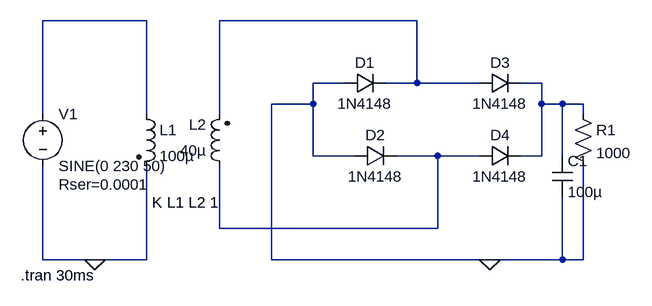
[diagram p0: schematic EXP-1_BridgeRectifier.asc]
EXP-1_BridgeRectifier.asc, the LTspice schematic file:
Version 4
SHEET 1 980 680
WIRE 224 -16 64 -16
WIRE 640 -16 336 -16
WIRE 528 80 480 80
WIRE 640 80 640 -16
WIRE 640 80 592 80
WIRE 736 80 640 80
WIRE 832 80 800 80
WIRE 480 112 480 80
WIRE 480 112 416 112
WIRE 832 112 832 80
WIRE 864 112 832 112
WIRE 896 112 864 112
WIRE 64 128 64 -16
WIRE 224 128 224 -16
WIRE 336 128 336 -16
WIRE 896 128 896 112
WIRE 480 192 480 112
WIRE 544 192 480 192
WIRE 672 192 608 192
WIRE 736 192 672 192
WIRE 832 192 832 112
WIRE 832 192 800 192
WIRE 864 192 864 112
WIRE 336 304 336 208
WIRE 672 304 672 192
WIRE 672 304 336 304
WIRE 64 352 64 208
WIRE 144 352 64 352
WIRE 224 352 224 208
WIRE 224 352 144 352
WIRE 416 352 416 112
WIRE 752 352 416 352
WIRE 864 352 864 256
WIRE 864 352 752 352
WIRE 896 352 896 208
WIRE 896 352 864 352
FLAG 144 352 0
FLAG 752 352 0
SYMBOL voltage 64 112 R0
WINDOW 123 0 0 Left 0
WINDOW 39 24 124 Left 2
SYMATTR InstName V1
SYMATTR Value SINE(0 230 50)
SYMATTR SpiceLine Rser=0.0001
SYMBOL ind2 208 112 R0
SYMATTR InstName L1
SYMATTR Value 100µ
SYMATTR Type ind
SYMBOL ind2 352 224 R180
WINDOW 0 36 80 Left 2
WINDOW 3 36 40 Left 2
SYMATTR InstName L2
SYMATTR Value 40µ
SYMATTR Type ind
SYMBOL diode 528 96 R270
WINDOW 0 32 32 VTop 2
WINDOW 3 0 32 VBottom 2
SYMATTR InstName D1
SYMATTR Value 1N4148
SYMBOL diode 544 208 R270
WINDOW 0 32 32 VTop 2
WINDOW 3 0 32 VBottom 2
SYMATTR InstName D2
SYMATTR Value 1N4148
SYMBOL diode 736 96 R270
WINDOW 0 32 32 VTop 2
WINDOW 3 0 32 VBottom 2
SYMATTR InstName D3
SYMATTR Value 1N4148
SYMBOL diode 736 208 R270
WINDOW 0 32 32 VTop 2
WINDOW 3 0 32 VBottom 2
SYMATTR InstName D4
SYMATTR Value 1N4148
SYMBOL res 880 112 R0
SYMATTR InstName R1
SYMATTR Value 1000
SYMBOL cap 848 192 R0
SYMATTR InstName C1
SYMATTR Value 100µ
TEXT 232 264 Left 2 !K L1 L2 1
TEXT 30 376 Left 2 !.tran 30ms

The netlist it stands for:
* EXP-1_BridgeRectifier.asc
V1 N001 0 SINE(0 230 50) Rser=0.0001
L1 N001 0 100µ
L2 N004 N002 40µ
D1 0 N002 1N4148
D2 0 N004 1N4148
D3 N002 N003 1N4148
D4 N004 N003 1N4148
R1 N003 0 1000
C1 N003 0 100µ
.model D D
.lib standard.dio
K L1 L2 1
.tran 30ms
.backanno
.end